# EAGLE schematic Muntjac (EAGLE 6.5.0)

## Sheet 1 of 6: CC2538 Core
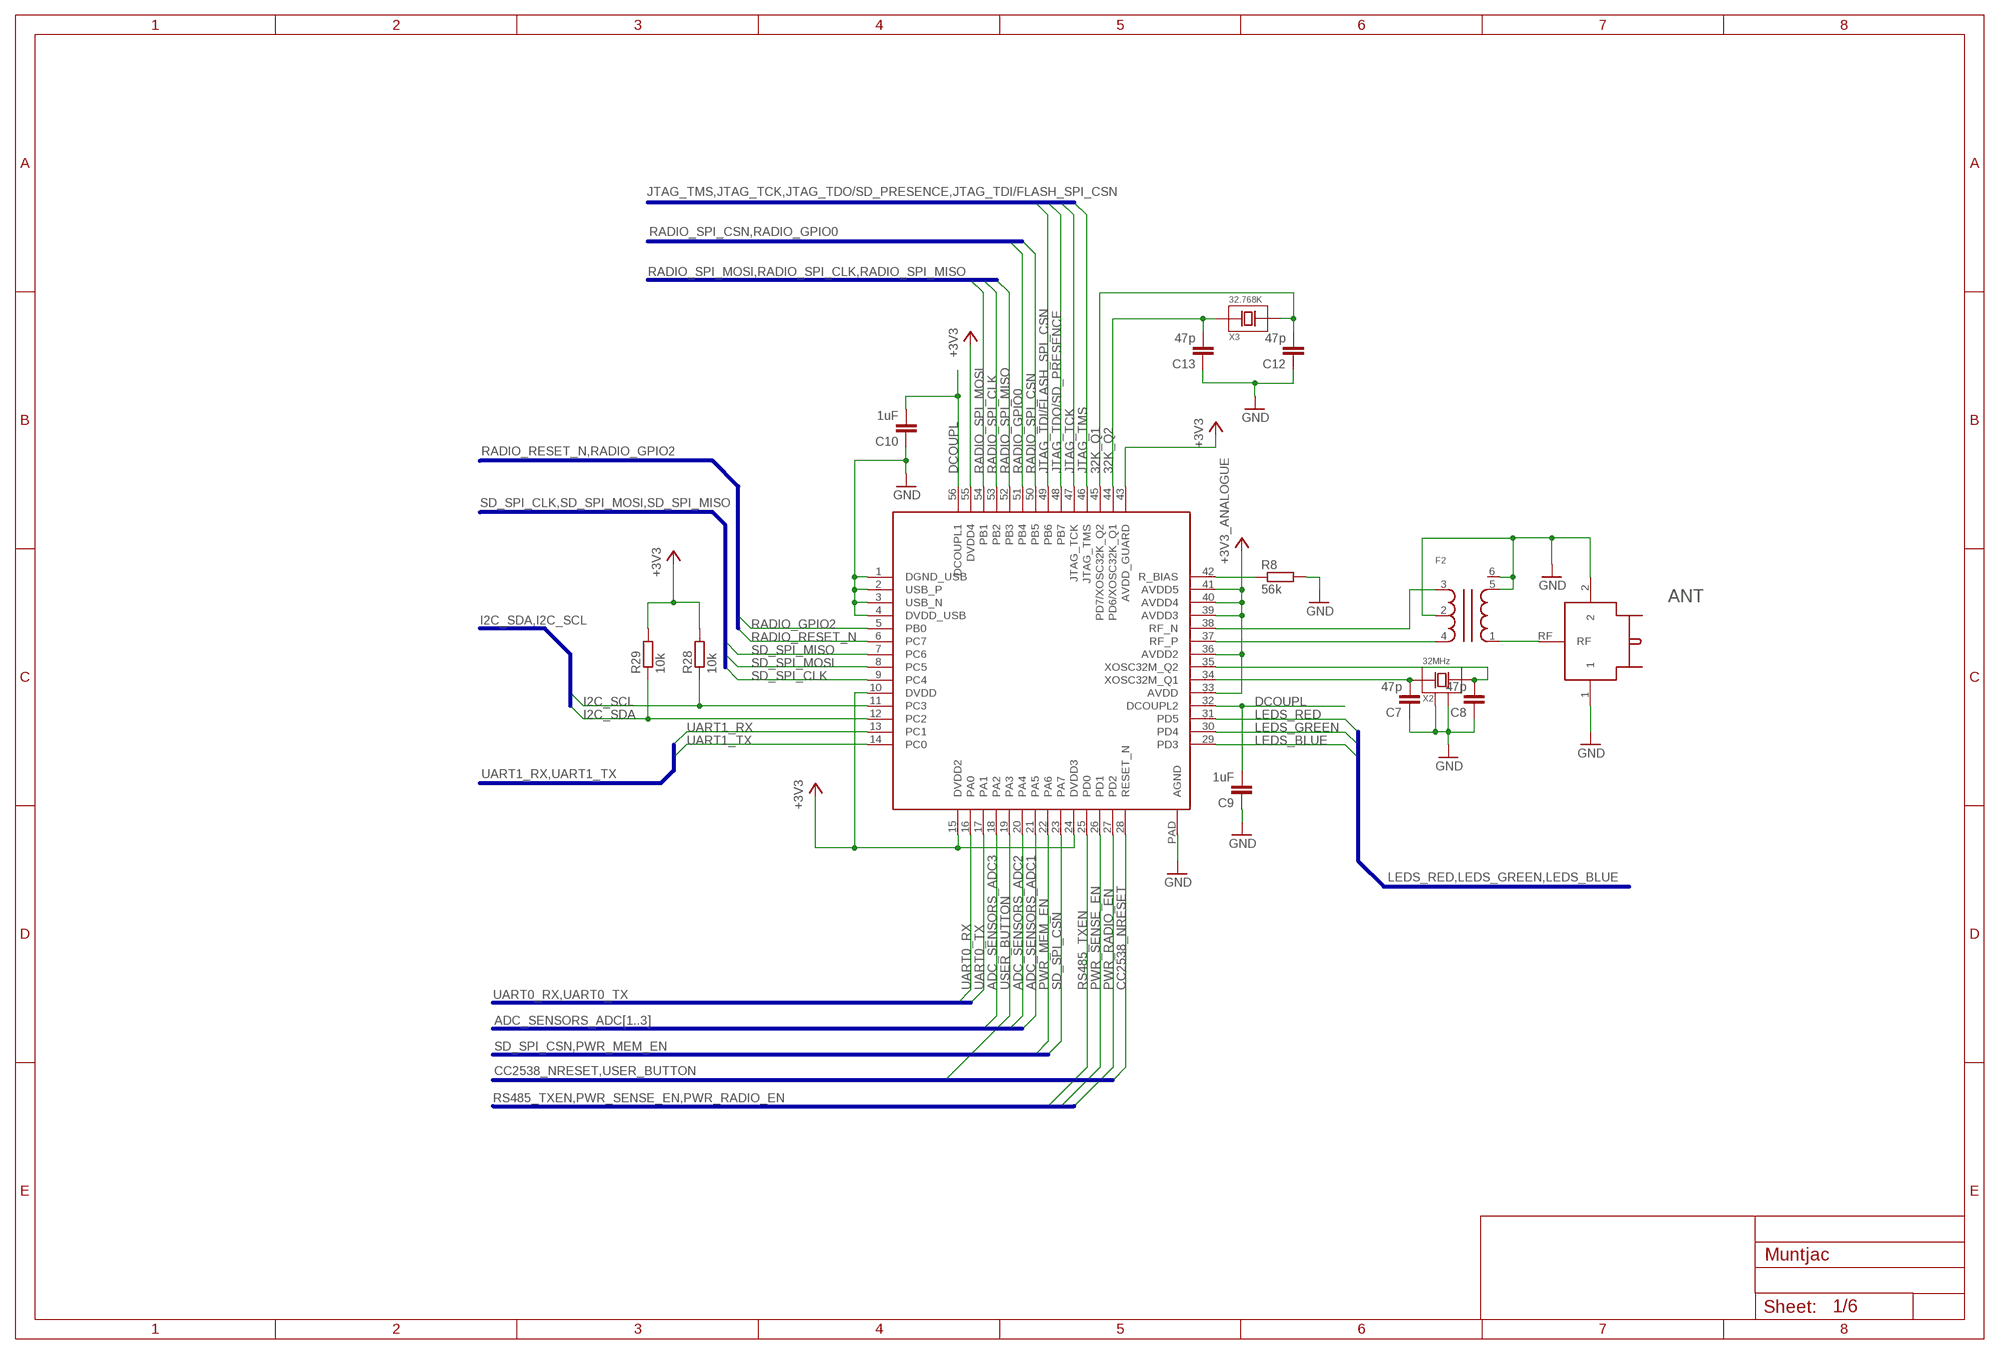
[diagram p0: schematic, sheet 1]

### Parts
ANT  UFL  [UFL-HIROSE]
C7  47p  C-EUC0603  [C0603]
C8  47p  C-EUC0603  [C0603]
C9  1uF  C-EUC0603  [C0603]
C10  1uF  C-EUC0603  [C0603]
C12  47p  C-EUC0603  [C0603]
C13  47p  C-EUC0603  [C0603]
F2  BALUN-2.4G  [2450BM15A0015]
R8  56k  R-EU_R0603  [R0603]
R28  10k  R-EU_R0603  [R0603]
R29  10k  R-EU_R0603  [R0603]
U1  CC2538  [QFN56]
X2  32MHz  ABM8G-ABM8G  [XTAL-3.2X2.5]
X3  32.768K  ABS07  [XTAL-3.2X1.5]

### Nets
2.4G: ANT.RF F2.1
32K_Q1: C12.2 U1.45(PD7/XOSC32K_Q2) X3.2
32K_Q2: C13.2 U1.44(PD6/XOSC32K_Q1) X3.1
32M_Q1: C7.2 U1.34(XOSC32M_Q1) X2.1
32M_Q2: C8.2 U1.35(XOSC32M_Q2) X2.3
+3V3: R28.2 R29.2 U1.10(DVDD) U1.15(DVDD2) U1.24(DVDD3) U1.43(AVDD_GUARD) U1.55(DVDD4) ; also sheet 2,4,5,6
+3V3_ANALOGUE: U1.33(AVDD) U1.36(AVDD2) U1.39(AVDD3) U1.40(AVDD4) U1.41(AVDD5) ; also sheet 5,6
ADC_SENSORS_ADC1: U1.21(PA5) ; also sheet 6
ADC_SENSORS_ADC2: U1.20(PA4) ; also sheet 6
ADC_SENSORS_ADC3: U1.18(PA2) ; also sheet 6
CC2538_NRESET: U1.28(RESET_N) ; also sheet 3,5,6
DCOUPL: C9.2 C10.2 U1.32(DCOUPL2) U1.56(DCOUPL1)
GND: ANT.1 ANT.2 C7.1 C8.1 C9.1 C10.1 C12.1 C13.1 F2.2 F2.5 F2.6 R8.2 U1.1(DGND_USB) U1.2(USB_P) U1.3(USB_N) U1.4(DVDD_USB) U1.PAD(AGND) X2.2 X2.4 ; also sheet 2,3,4,5,6
I2C_SCL: R28.1 U1.11(PC3) ; also sheet 5,6
I2C_SDA: R29.1 U1.12(PC2) ; also sheet 5,6
JTAG_TCK: U1.47(JTAG_TCK) ; also sheet 6
JTAG_TDI/FLASH_SPI_CSN: U1.49(PB6) ; also sheet 4,6
JTAG_TDO/SD_PRESENCE: U1.48(PB7) ; also sheet 4,6
JTAG_TMS: U1.46(JTAG_TMS) ; also sheet 6
LEDS_BLUE: U1.29(PD3) ; also sheet 5
LEDS_GREEN: U1.30(PD4) ; also sheet 5
LEDS_RED: U1.31(PD5) ; also sheet 5
N$21: R8.1 U1.42(R_BIAS)
N$28: F2.4 U1.37(RF_P)
N$29: F2.3 U1.38(RF_N)
PWR_MEM_EN: U1.22(PA6) ; also sheet 4
PWR_RADIO_EN: U1.27(PD2) ; also sheet 2,6
PWR_SENSE_EN: U1.26(PD1) ; also sheet 5,6
RADIO_GPIO0: U1.51(PB4) ; also sheet 2,6
RADIO_GPIO2: U1.5(PB0) ; also sheet 2,6
RADIO_RESET_N: U1.6(PC7) ; also sheet 2,6
RADIO_SPI_CLK: U1.53(PB2) ; also sheet 2,6
RADIO_SPI_CSN: U1.50(PB5) ; also sheet 2,6
RADIO_SPI_MISO: U1.52(PB3) ; also sheet 2,6
RADIO_SPI_MOSI: U1.54(PB1) ; also sheet 2,6
RS485_TXEN: U1.25(PD0) ; also sheet 6
SD_SPI_CLK: U1.9(PC4) ; also sheet 4,6
SD_SPI_CSN: U1.23(PA7) ; also sheet 4
SD_SPI_MISO: U1.7(PC6) ; also sheet 4,6
SD_SPI_MOSI: U1.8(PC5) ; also sheet 4,6
UART0_RX: U1.16(PA0) ; also sheet 3,6
UART0_TX: U1.17(PA1) ; also sheet 3,6
UART1_RX: U1.13(PC1) ; also sheet 6
UART1_TX: U1.14(PC0) ; also sheet 6
USER_BUTTON: U1.19(PA3) ; also sheet 3,5,6

### Buses
UART1_RX,UART1_TX
SD_SPI_CLK,SD_SPI_MOSI,SD_SPI_MISO
UART0_RX,UART0_TX
RADIO_SPI_MOSI,RADIO_SPI_CLK,RADIO_SPI_MISO
JTAG_TMS,JTAG_TCK,JTAG_TDO/SD_PRESENCE,JTAG_TDI/FLASH_SPI_CSN
RADIO_SPI_CSN,RADIO_GPIO0
LEDS_RED,LEDS_GREEN,LEDS_BLUE
ADC_SENSORS_ADC[1..3]
CC2538_NRESET,USER_BUTTON
SD_SPI_CSN,PWR_MEM_EN
RS485_TXEN,PWR_SENSE_EN,PWR_RADIO_EN
RADIO_RESET_N,RADIO_GPIO2
I2C_SDA,I2C_SCL

## Sheet 2 of 6: CC1200
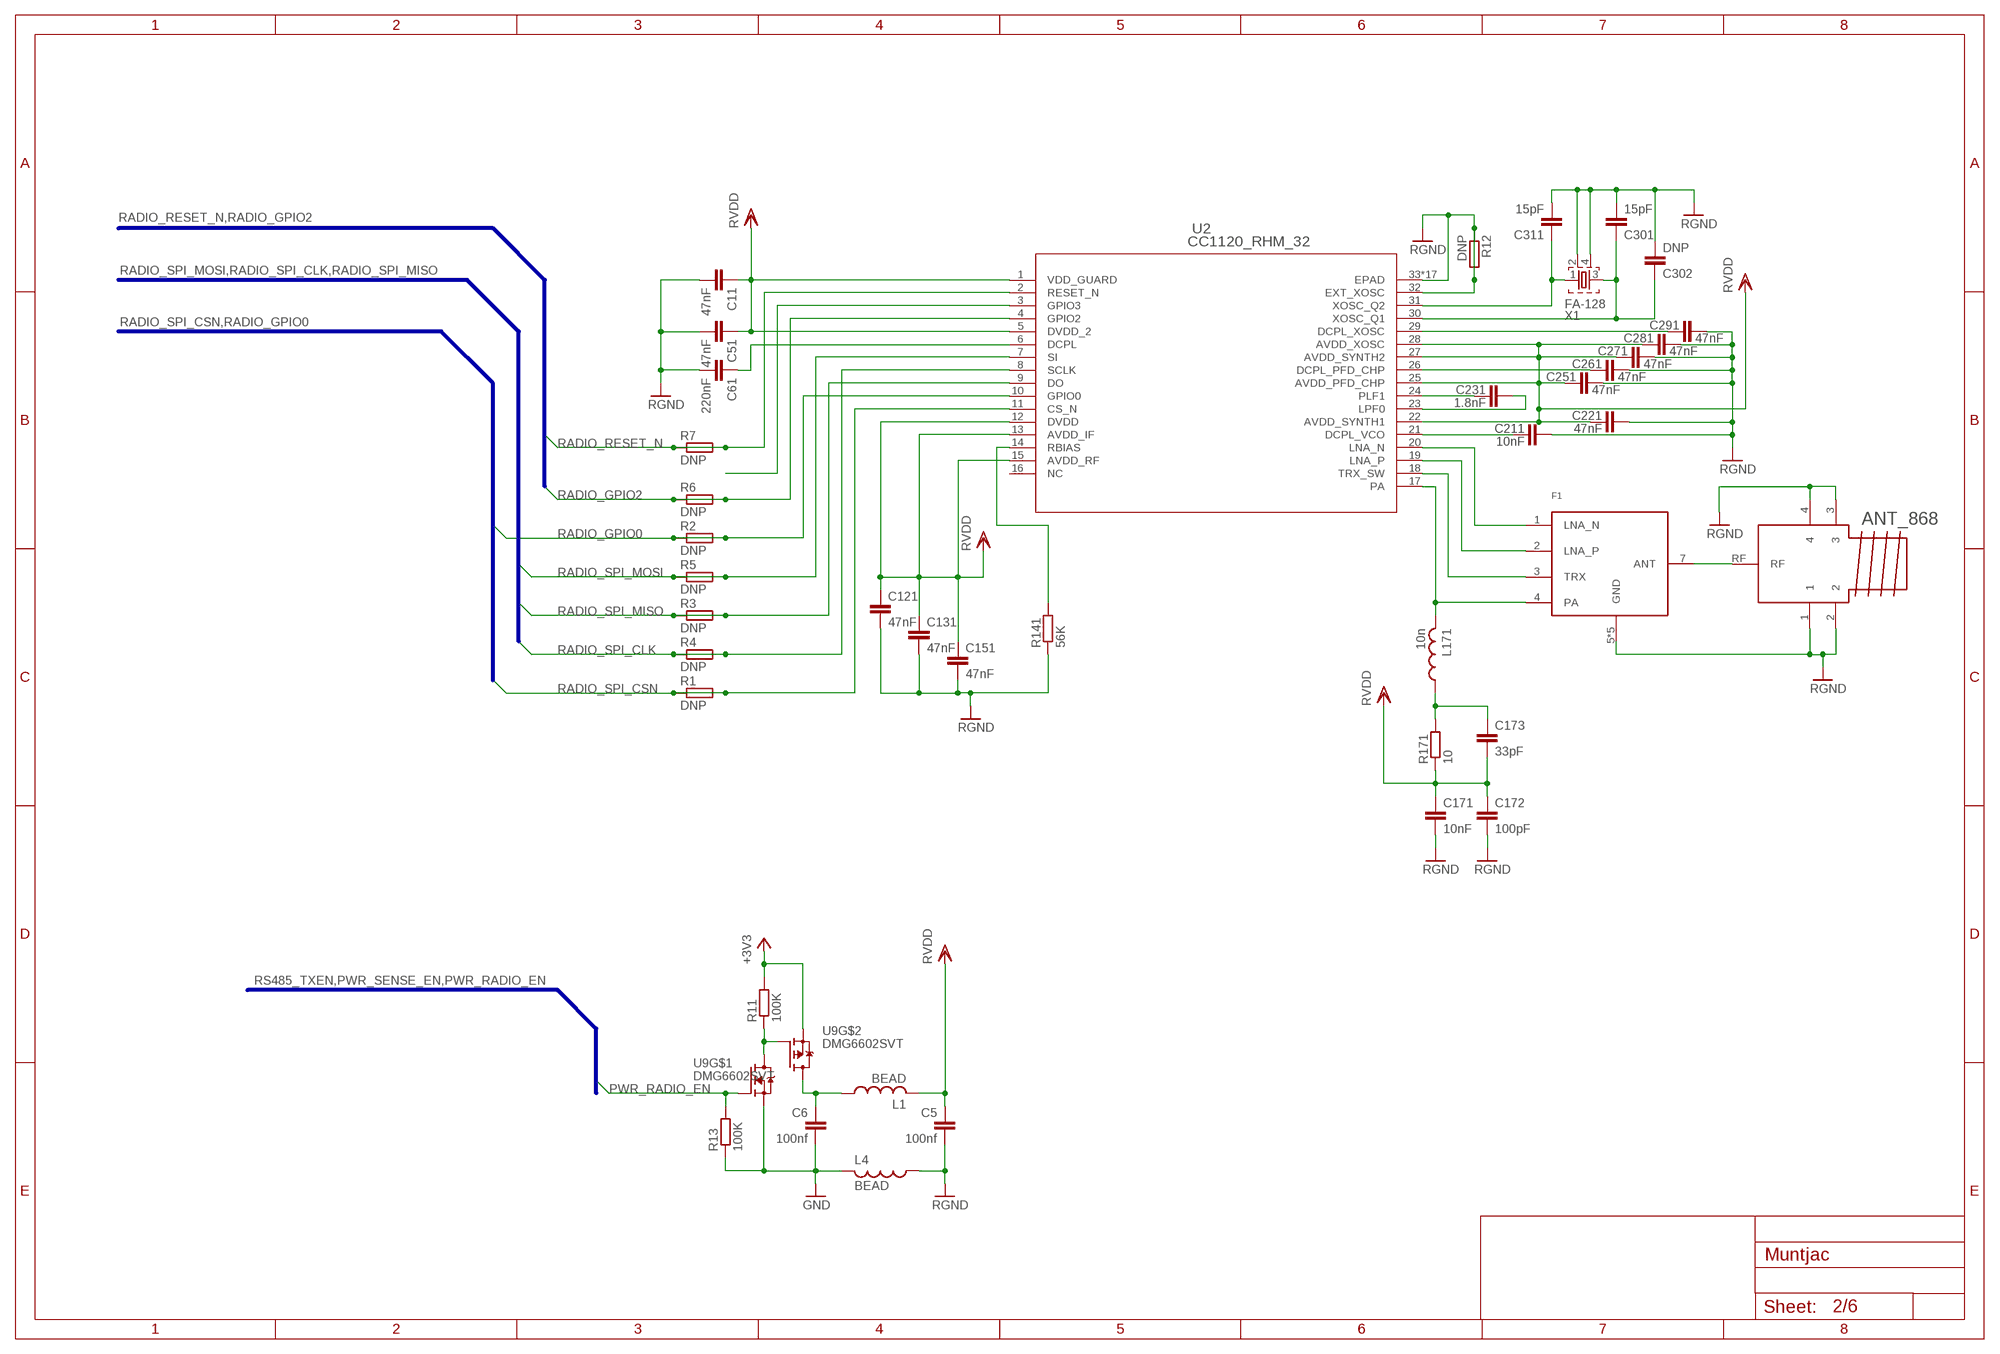
[diagram p1: schematic, sheet 2]

### Parts
ANT_868  SMA  [JOHNSON_142-0701-806]
C5  100nf  C_EUC0603S  [C0603]
C6  100nf  C_EUC0603S  [C0603]
C11  47nF  C_EU0402S  [C0402_SMALL]
C51  47nF  C_EU0402S  [C0402_SMALL]
C61  220nF  C_EU0402S  [C0402_SMALL]
C121  47nF  C_EU0402S  [C0402_SMALL]
C131  47nF  C_EU0402S  [C0402_SMALL]
C151  47nF  C_EU0402S  [C0402_SMALL]
C171  10nF  C_EU0402S  [C0402_SMALL]
C172  100pF  C_EU0402S  [C0402_SMALL]
C173  33pF  C_EU0402S  [C0402_SMALL]
C211  10nF  C_EU0402S  [C0402_SMALL]
C221  47nF  C_EU0402S  [C0402_SMALL]
C231  1.8nF  C_EU0402S  [C0402_SMALL]
C251  47nF  C_EU0402S  [C0402_SMALL]
C261  47nF  C_EU0402S  [C0402_SMALL]
C271  47nF  C_EU0402S  [C0402_SMALL]
C281  47nF  C_EU0402S  [C0402_SMALL]
C291  47nF  C_EU0402S  [C0402_SMALL]
C301  15pF  C_EU0402S  [C0402_SMALL]
C302  DNP  C_EU0402S  [C0402_SMALL]
C311  15pF  C_EU0402S  [C0402_SMALL]
F1  0900PC15J0013  [0900PC15J0013]
L1  BEAD  L_US0603  [C0603]
L4  BEAD  L_US0603  [C0603]
L171  10n  L_US0402S  [C0402_SMALL]
R1  DNP  R-EU_R0402  [R0402]
R2  DNP  R-EU_R0402  [R0402]
R3  DNP  R-EU_R0402  [R0402]
R4  DNP  R-EU_R0402  [R0402]
R5  DNP  R-EU_R0402  [R0402]
R6  DNP  R-EU_R0402  [R0402]
R7  DNP  R-EU_R0402  [R0402]
R11  100K  R-EU_R0603  [R0603]
R12  DNP  R_EU  [C0402_SMALL]
R13  100K  R-EU_R0603  [R0603]
R141  56K  R_EU  [C0402_SMALL]
R171  10  R_EU  [C0402_SMALL]
U2  CC1120_RHM_32  [RHM32_3P7X3P7]
U9  DMG6602SVT  [TSOT26]
X1  FA-128  [FA-128]

### Nets
+3V3: R11.2 U9.P$2(S) ; also sheet 1,4,5,6
GND: C6.2 L4.2 R13.1 U9.P$5(S) ; also sheet 1,3,4,5,6
N$1: C231.1 U2.24(PLF1)
N$2: C231.2 U2.23(LPF0)
N$3: C211.1 U2.21(DCPL_VCO)
N$4: C61.1 U2.6(DCPL)
N$5: C261.1 U2.26(DCPL_PFD_CHP)
N$6: C311.1 U2.31(XOSC_Q2) X1.1
N$7: C301.1 C302.1 U2.30(XOSC_Q1) X1.3
N$8: C291.1 U2.29(DCPL_XOSC)
N$9: F1.1(LNA_N) U2.20(LNA_N)
N$10: F1.2(LNA_P) U2.19(LNA_P)
N$11: ANT_868.RF F1.7(ANT)
N$12: F1.3(TRX) U2.18(TRX_SW)
N$13: R141.2 U2.14(RBIAS)
N$14: F1.4(PA) L171.2 U2.17(PA)
N$19: C173.1 L171.1 R171.2
N$31: C6.1 L1.1 U9.P$4(D)
N$34: R11.1 U9.P$3(G) U9.P$6(D)
PWR_RADIO_EN: R13.2 U9.P$1(G) ; also sheet 1,6
RADIO_GPIO0: R2.1 R2.2 U2.10(GPIO0) ; also sheet 1,6
RADIO_GPIO2: R6.1 R6.2 U2.4(GPIO2) ; also sheet 1,6
RADIO_GPIO3: U2.3(GPIO3)
RADIO_RESET_N: R7.1 R7.2 U2.2(RESET_N) ; also sheet 1,6
RADIO_SPI_CLK: R4.1 R4.2 U2.8(SCLK) ; also sheet 1,6
RADIO_SPI_CSN: R1.1 R1.2 U2.11(CS_N) ; also sheet 1,6
RADIO_SPI_MISO: R3.1 R3.2 U2.9(DO) ; also sheet 1,6
RADIO_SPI_MOSI: R5.1 R5.2 U2.7(SI) ; also sheet 1,6
RGND: ANT_868.1 ANT_868.2 ANT_868.3 ANT_868.4 C5.2 C11.2 C51.2 C61.2 C121.2 C131.2 C151.2 C171.2 C172.2 C211.2 C221.2 C251.2 C261.2 C271.2 C281.2 C291.2 C301.2 C302.2 C311.2 F1.5(GND) F1.6(GND) F1.8(GND) F1.9(GND) F1.10(GND) L4.1 R12.1 R12.2 R141.1 U2.32(EXT_XOSC) U2.33(EPAD) U2.V(EPAD) U2.V_2(EPAD) U2.V_3(EPAD) U2.V_4(EPAD) U2.V_5(EPAD) U2.V_6(EPAD) U2.V_7(EPAD) U2.V_8(EPAD) U2.V_9(EPAD) U2.V_10(EPAD) U2.V_11(EPAD) U2.V_12(EPAD) U2.V_13(EPAD) U2.V_14(EPAD) U2.V_15(EPAD) U2.V_16(EPAD) X1.2 X1.4
RVDD: C5.1 C11.1 C51.1 C121.1 C131.1 C151.1 C171.1 C172.1 C173.2 C221.1 C251.1 C271.1 C281.1 L1.2 R171.1 U2.1(VDD_GUARD) U2.5(DVDD_2) U2.12(DVDD) U2.13(AVDD_IF) U2.15(AVDD_RF) U2.22(AVDD_SYNTH1) U2.25(AVDD_PFD_CHP) U2.27(AVDD_SYNTH2) U2.28(AVDD_XOSC)
Unconnected: U2.16(NC)

### Buses
RS485_TXEN,PWR_SENSE_EN,PWR_RADIO_EN
RADIO_SPI_CSN,RADIO_GPIO0
RADIO_SPI_MOSI,RADIO_SPI_CLK,RADIO_SPI_MISO
RADIO_RESET_N,RADIO_GPIO2

## Sheet 3 of 6: BSL/Serial Interface
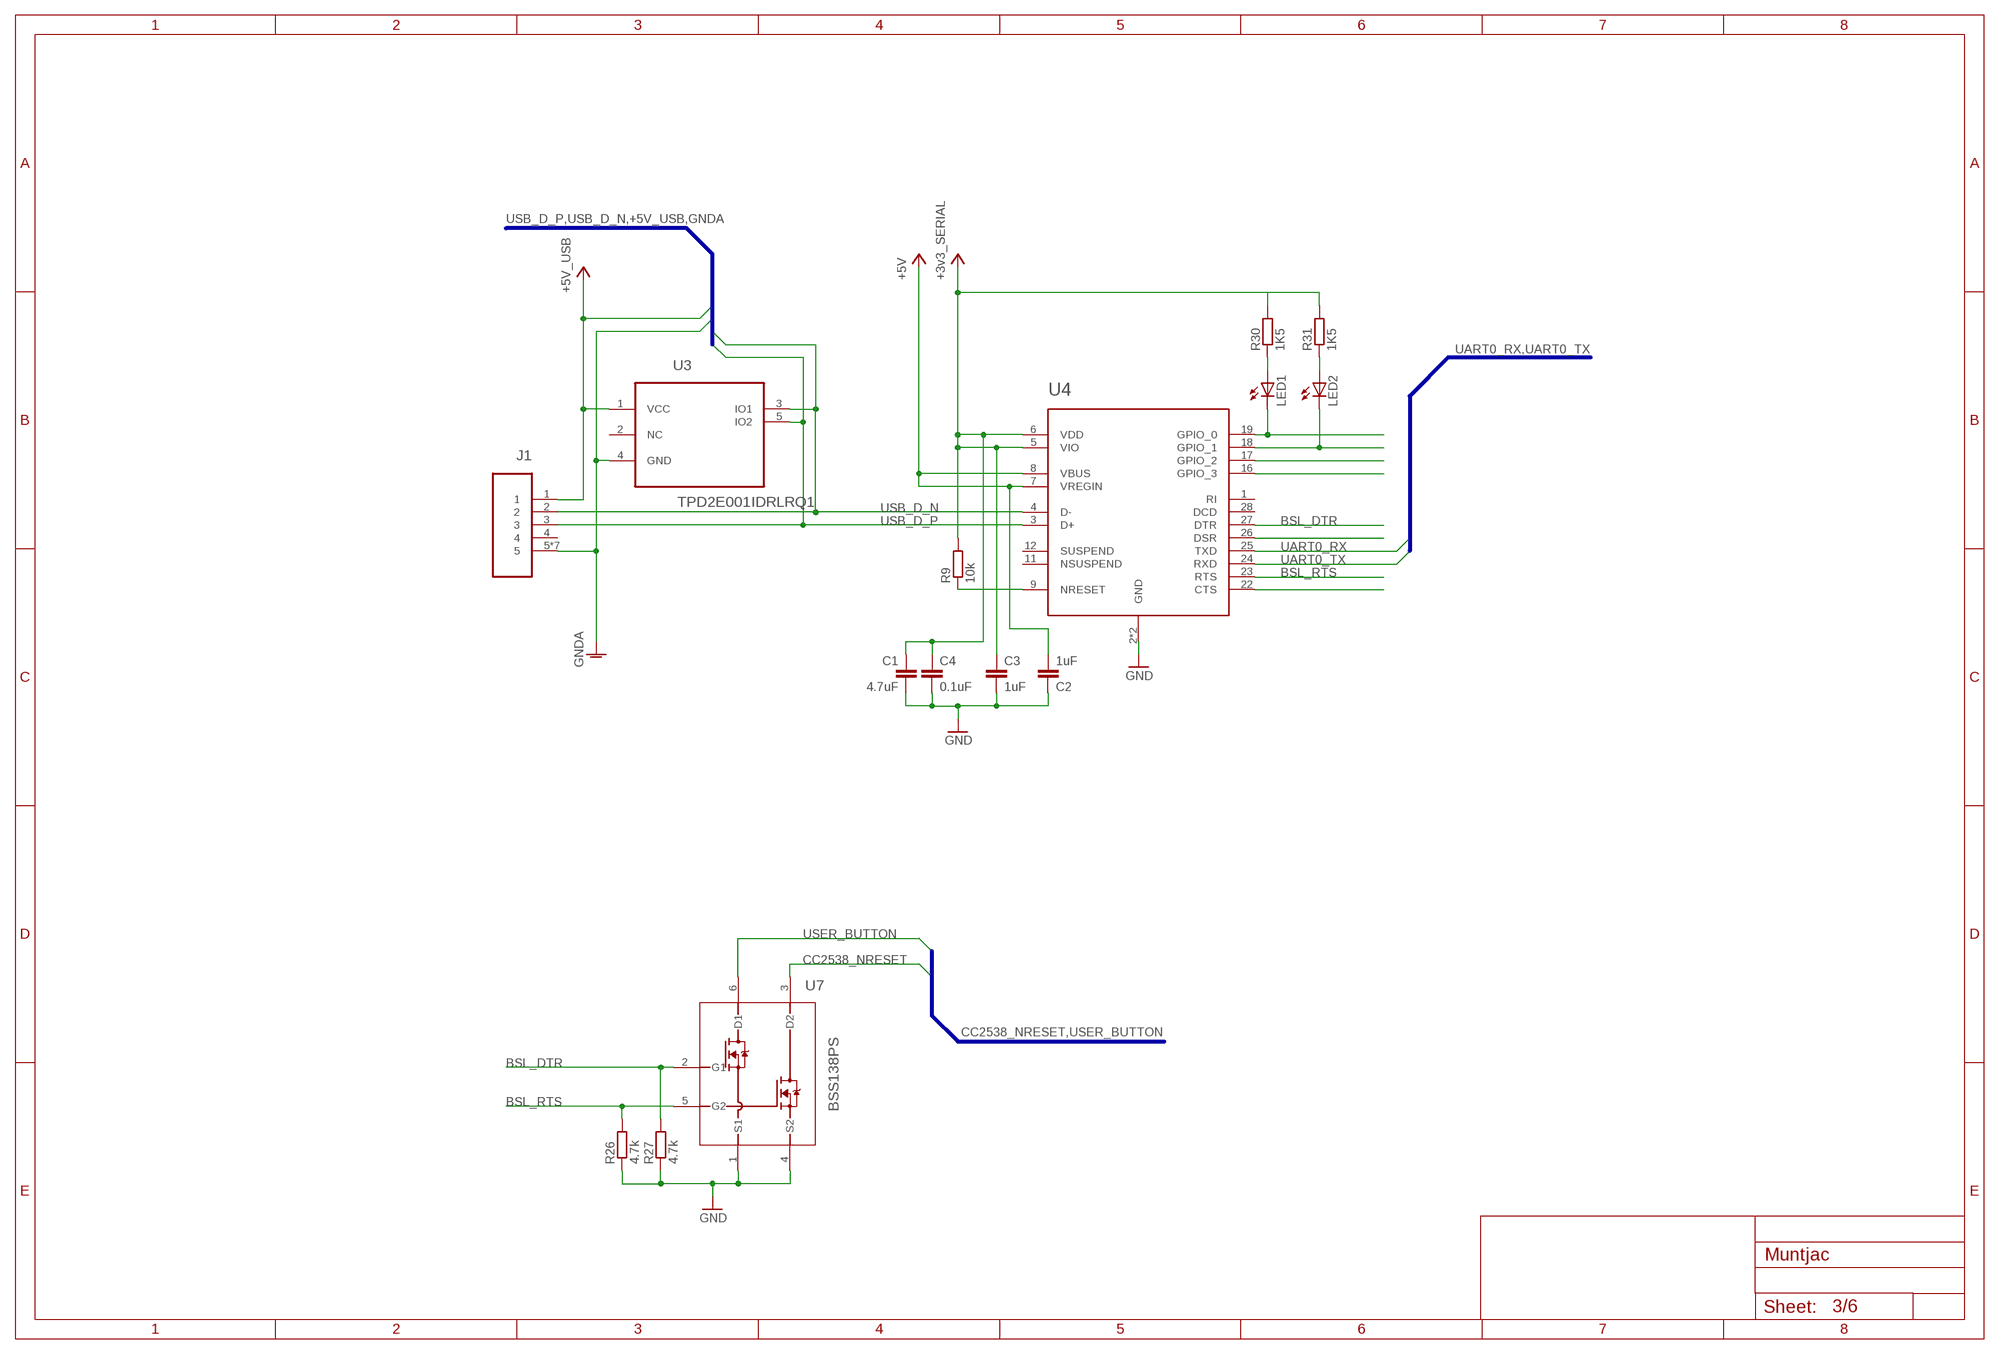
[diagram p2: schematic, sheet 3]

### Parts
C1  4.7uF  C_EUC0603S  [C0603]
C2  1uF  C_EUC0603S  [C0603]
C3  1uF  C_EUC0603S  [C0603]
C4  0.1uF  C_EUC0603S  [C0603]
J1  47346-0001  [MOLEX_47346-0001]
LED1  LEDSML0603  [SML0603]
LED2  LEDSML0603  [SML0603]
R9  10k  R-EU_R0603  [R0603]
R26  4.7k  R-EU_R0603  [R0603]
R27  4.7k  R-EU_R0603  [R0603]
R30  1K5  R-EU_R0603  [R0603]
R31  1K5  R-EU_R0603  [R0603]
U3  TPD2E001IDRLRQ1  [SOT50P160X60-5N]
U4  CP2103  [QFN50P500X500X100-29N]
U7  BSS138PS  [SOT65P210X110-6N]

### Nets
+3V3_SERIAL: C1.1 C3.1 C4.1 R9.2 R30.2 R31.2 U4.5(VIO) U4.6(VDD) ; supply symbol labelled +3v3_SERIAL ; also sheet 5,6
+5V: C2.2 U4.7(VREGIN) U4.8(VBUS) ; also sheet 5
+5V_USB: J1.1 U3.1(VCC) ; also sheet 5,6
BSL_DTR: R27.2 U4.27(DTR) U7.2(G1)
BSL_RTS: R26.2 U4.23(RTS) U7.5(G2)
CC2538_NRESET: U7.3(D2) ; also sheet 1,5,6
GND: C1.2 C2.1 C3.2 C4.2 R26.1 R27.1 U4.2(GND) U4.29(GND) U7.1(S1) U7.4(S2) ; also sheet 1,2,4,5,6
GNDA: J1.5 J1.M1 J1.M2 J1.M3 J1.M4 J1.M5 J1.M6 U3.4(GND) ; also sheet 5,6
N$15: LED1.C U4.19(GPIO_0)
N$16: U4.26(DSR)
N$17: LED2.C U4.18(GPIO_1)
N$18: U4.22(CTS)
N$20: LED1.A R30.1
N$26: U4.17(GPIO_2)
N$27: R9.1 U4.9(NRESET)
N$30: U4.16(GPIO_3)
N$40: LED2.A R31.1
UART0_RX: U4.25(TXD) ; also sheet 1,6
UART0_TX: U4.24(RXD) ; also sheet 1,6
USB_D_N: J1.2 U3.3(IO1) U4.4(D-) ; also sheet 6
USB_D_P: J1.3 U3.5(IO2) U4.3(D+) ; also sheet 6
USER_BUTTON: U7.6(D1) ; also sheet 1,5,6
Unconnected: J1.4 U3.2(NC) U4.1(RI) U4.11(NSUSPEND) U4.12(SUSPEND) U4.28(DCD)

### Buses
USB_D_P,USB_D_N,+5V_USB,GNDA
UART0_RX,UART0_TX
CC2538_NRESET,USER_BUTTON

## Sheet 4 of 6: Storage
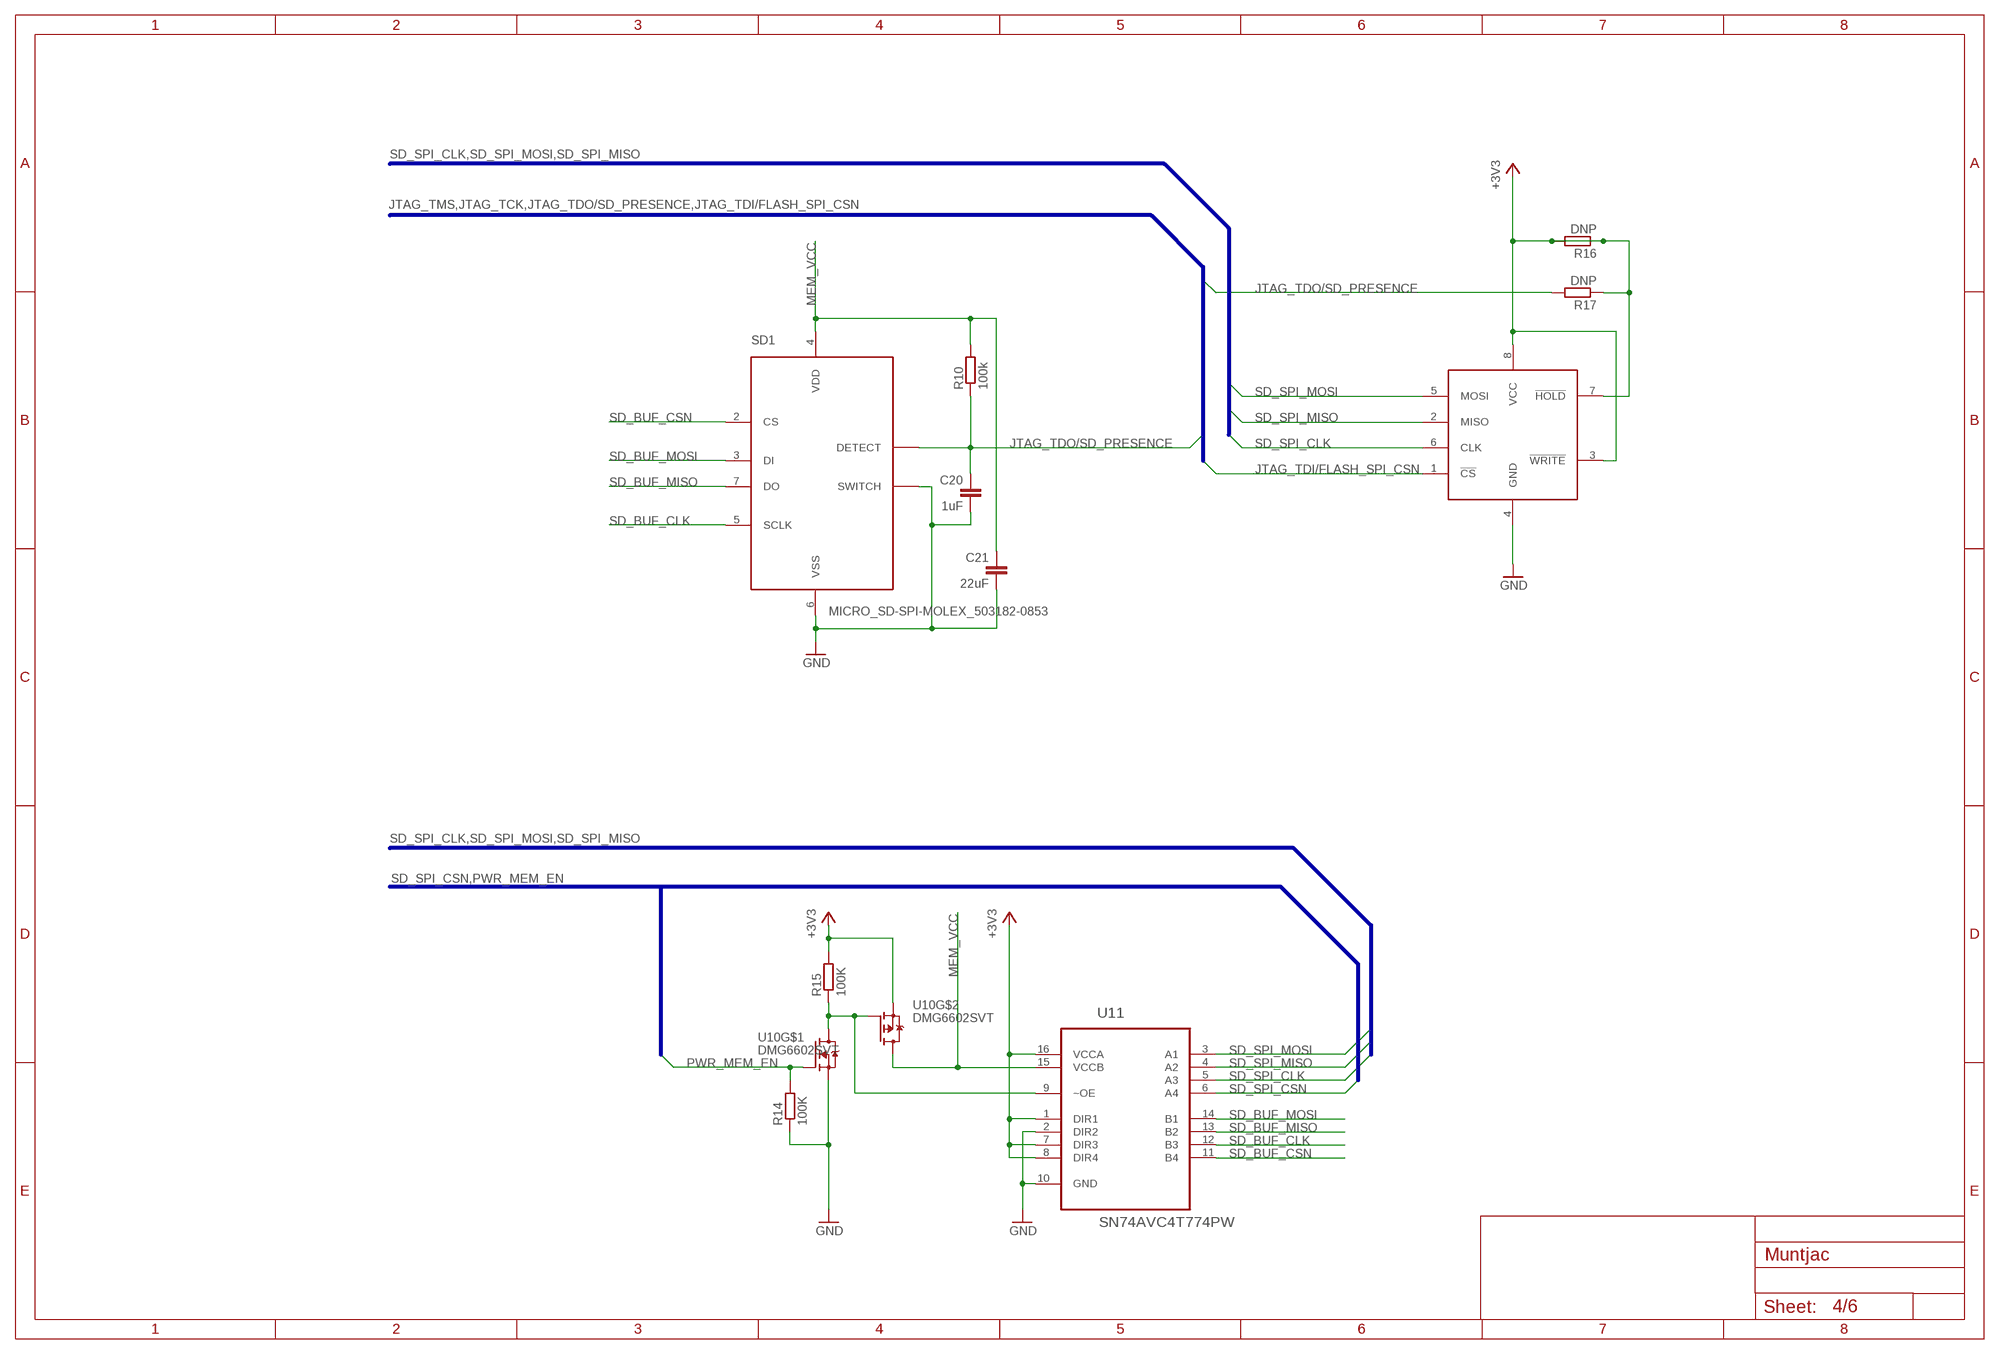
[diagram p3: schematic, sheet 4]

### Parts
C20  1uF  C_EUC0603S  [C0603]
C21  22uF  C_EUC0603S  [C0603]
R10  100k  R-EU_R0603  [R0603]
R14  100K  R-EU_R0603  [R0603]
R15  100K  R-EU_R0603  [R0603]
R16  DNP  R-EU_R0402  [R0402]
R17  DNP  R-EU_R0402  [R0402]
SD1  MICRO_SD-SPI-MOLEX_503182-0853  [MICRO_SD-MOLEX_503182-0853]
U8  M25P16VMN6P  [SOIC8]
U10  DMG6602SVT  [TSOT26]
U11  SN74AVC4T774PW  [SOP65P640X120-16N]

### Nets
+3V3: R15.2 R16.1 R16.2 R17.1 U8.3(!WRITE) U8.7(!HOLD) U8.8(VCC) U10.P$2(S) U11.1(DIR1) U11.7(DIR3) U11.8(DIR4) U11.16(VCCA) ; also sheet 1,2,5,6
GND: C20.2 C21.2 R14.1 SD1.6(VSS) SD1.SWITCH U8.4(GND) U10.P$5(S) U11.2(DIR2) U11.10(GND) ; also sheet 1,2,3,5,6
JTAG_TDI/FLASH_SPI_CSN: U8.1(!CS) ; also sheet 1,6
JTAG_TDO/SD_PRESENCE: C20.1 R10.1 R17.2 SD1.DETECT ; also sheet 1,6
MEM_VCC: C21.1 R10.2 SD1.4(VDD) U10.P$4(D) U11.15(VCCB)
N$42: R15.1 U10.P$3(G) U10.P$6(D) U11.9(~OE)
PWR_MEM_EN: R14.2 U10.P$1(G) ; also sheet 1
SD_BUF_CLK: SD1.5(SCLK) U11.12(B3)
SD_BUF_CSN: SD1.2(CS) U11.11(B4)
SD_BUF_MISO: SD1.7(DO) U11.13(B2)
SD_BUF_MOSI: SD1.3(DI) U11.14(B1)
SD_SPI_CLK: U8.6(CLK) U11.5(A3) ; also sheet 1,6
SD_SPI_CSN: U11.6(A4) ; also sheet 1
SD_SPI_MISO: U8.2(MISO) U11.4(A2) ; also sheet 1,6
SD_SPI_MOSI: U8.5(MOSI) U11.3(A1) ; also sheet 1,6

### Buses
SD_SPI_CLK,SD_SPI_MOSI,SD_SPI_MISO
SD_SPI_CSN,PWR_MEM_EN
JTAG_TMS,JTAG_TCK,JTAG_TDO/SD_PRESENCE,JTAG_TDI/FLASH_SPI_CSN

## Sheet 5 of 6: Power & HMI
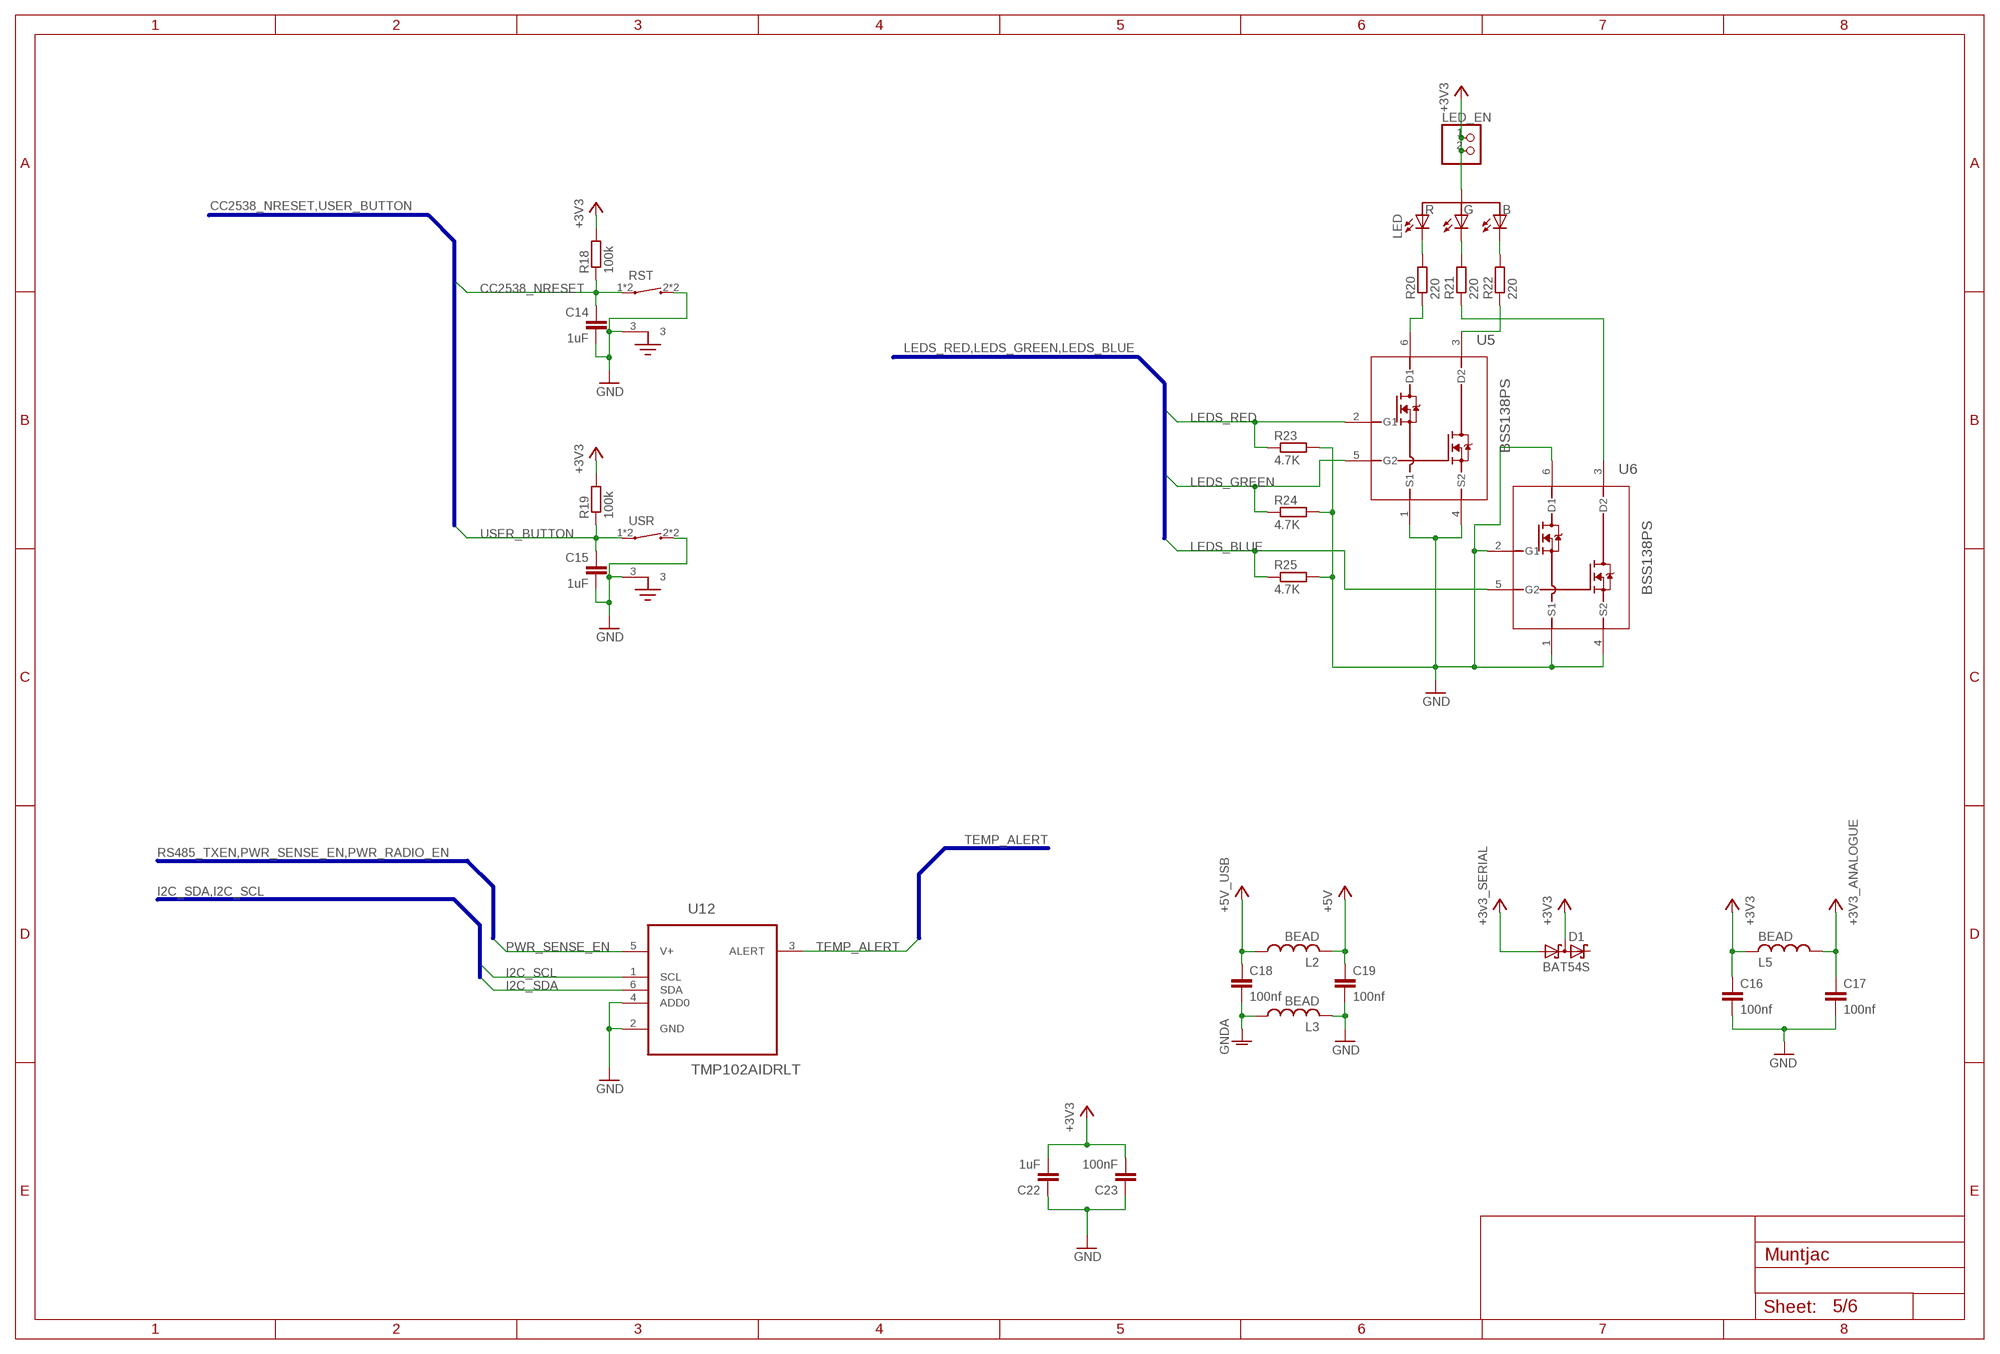
[diagram p4: schematic, sheet 5]

### Parts
C14  1uF  C_EUC0603S  [C0603]
C15  1uF  C_EUC0603S  [C0603]
C16  100nf  C_EUC0603S  [C0603]
C17  100nf  C_EUC0603S  [C0603]
C18  100nf  C_EUC0603S  [C0603]
C19  100nf  C_EUC0603S  [C0603]
C22  1uF  C_EUC0603S  [C0603]
C23  100nF  C_EUC0603S  [C0603]
D1  BAT54S  [SOT23]
L2  BEAD  L_US0603  [C0603]
L3  BEAD  L_US0603  [C0603]
L5  BEAD  L_US0603  [C0603]
LED  CLV1A-FKB-CJ1M1F1BB7R4S3  [PLCC-4_3.2X2.8]
LED_EN  PINHD-1X2  [1X02]
R18  100k  R-EU_R0603  [R0603]
R19  100k  R-EU_R0603  [R0603]
R20  220  R-EU_R0603  [R0603]
R21  220  R-EU_R0603  [R0603]
R22  220  R-EU_R0603  [R0603]
R23  4.7K  R-EU_R0603  [R0603]
R24  4.7K  R-EU_R0603  [R0603]
R25  4.7K  R-EU_R0603  [R0603]
RST  KMR2X1G  [C&K-KMR-5MM]
U5  BSS138PS  [SOT65P210X110-6N]
U6  BSS138PS  [SOT65P210X110-6N]
U12  TMP102AIDRLT  [SOT50P160X60-6N]
USR  KMR2X1G  [C&K-KMR-5MM]

### Nets
+3V3: C16.1 C22.2 C23.2 D1.3(C1A2) L5.2 LED.2 LED_EN.1 LED_EN.2 R18.2 R19.2 ; also sheet 1,2,4,6
+3V3_ANALOGUE: C17.1 L5.1 ; also sheet 1,6
+3V3_SERIAL: D1.1(A1) ; supply symbol labelled +3v3_SERIAL ; also sheet 3,6
+5V: C19.1 L2.2 ; also sheet 3
+5V_USB: C18.1 L2.1 ; also sheet 3,6
CC2538_NRESET: C14.1 R18.1 RST.1 RST.5 ; also sheet 1,3,6
GND: C14.2 C15.2 C16.2 C17.2 C19.2 C22.1 C23.1 L3.2 R23.2 R24.2 R25.2 RST.2 RST.3 RST.4 U5.1(S1) U5.4(S2) U6.1(S1) U6.2(G1) U6.4(S2) U6.6(D1) U12.2(GND) U12.4(ADD0) USR.2 USR.3 USR.4 ; also sheet 1,2,3,4,6
GNDA: C18.2 L3.1 ; also sheet 3,6
I2C_SCL: U12.1(SCL) ; also sheet 1,6
I2C_SDA: U12.6(SDA) ; also sheet 1,6
LEDS_BLUE: R25.1 U6.5(G2) ; also sheet 1
LEDS_GREEN: R24.1 U5.5(G2) ; also sheet 1
LEDS_RED: R23.1 U5.2(G1) ; also sheet 1
N$22: LED.1 R20.2
N$23: LED.3 R21.2
N$24: LED.4 R22.2
N$25: R20.1 U5.6(D1)
N$32: R21.1 U6.3(D2)
N$33: R22.1 U5.3(D2)
PWR_SENSE_EN: U12.5(V+) ; also sheet 1,6
TEMP_ALERT: U12.3(ALERT) ; also sheet 6
USER_BUTTON: C15.1 R19.1 USR.1 USR.5 ; also sheet 1,3,6
Unconnected: D1.2(C2)

### Buses
CC2538_NRESET,USER_BUTTON
LEDS_RED,LEDS_GREEN,LEDS_BLUE
I2C_SDA,I2C_SCL
TEMP_ALERT
RS485_TXEN,PWR_SENSE_EN,PWR_RADIO_EN

## Sheet 6 of 6: Headers
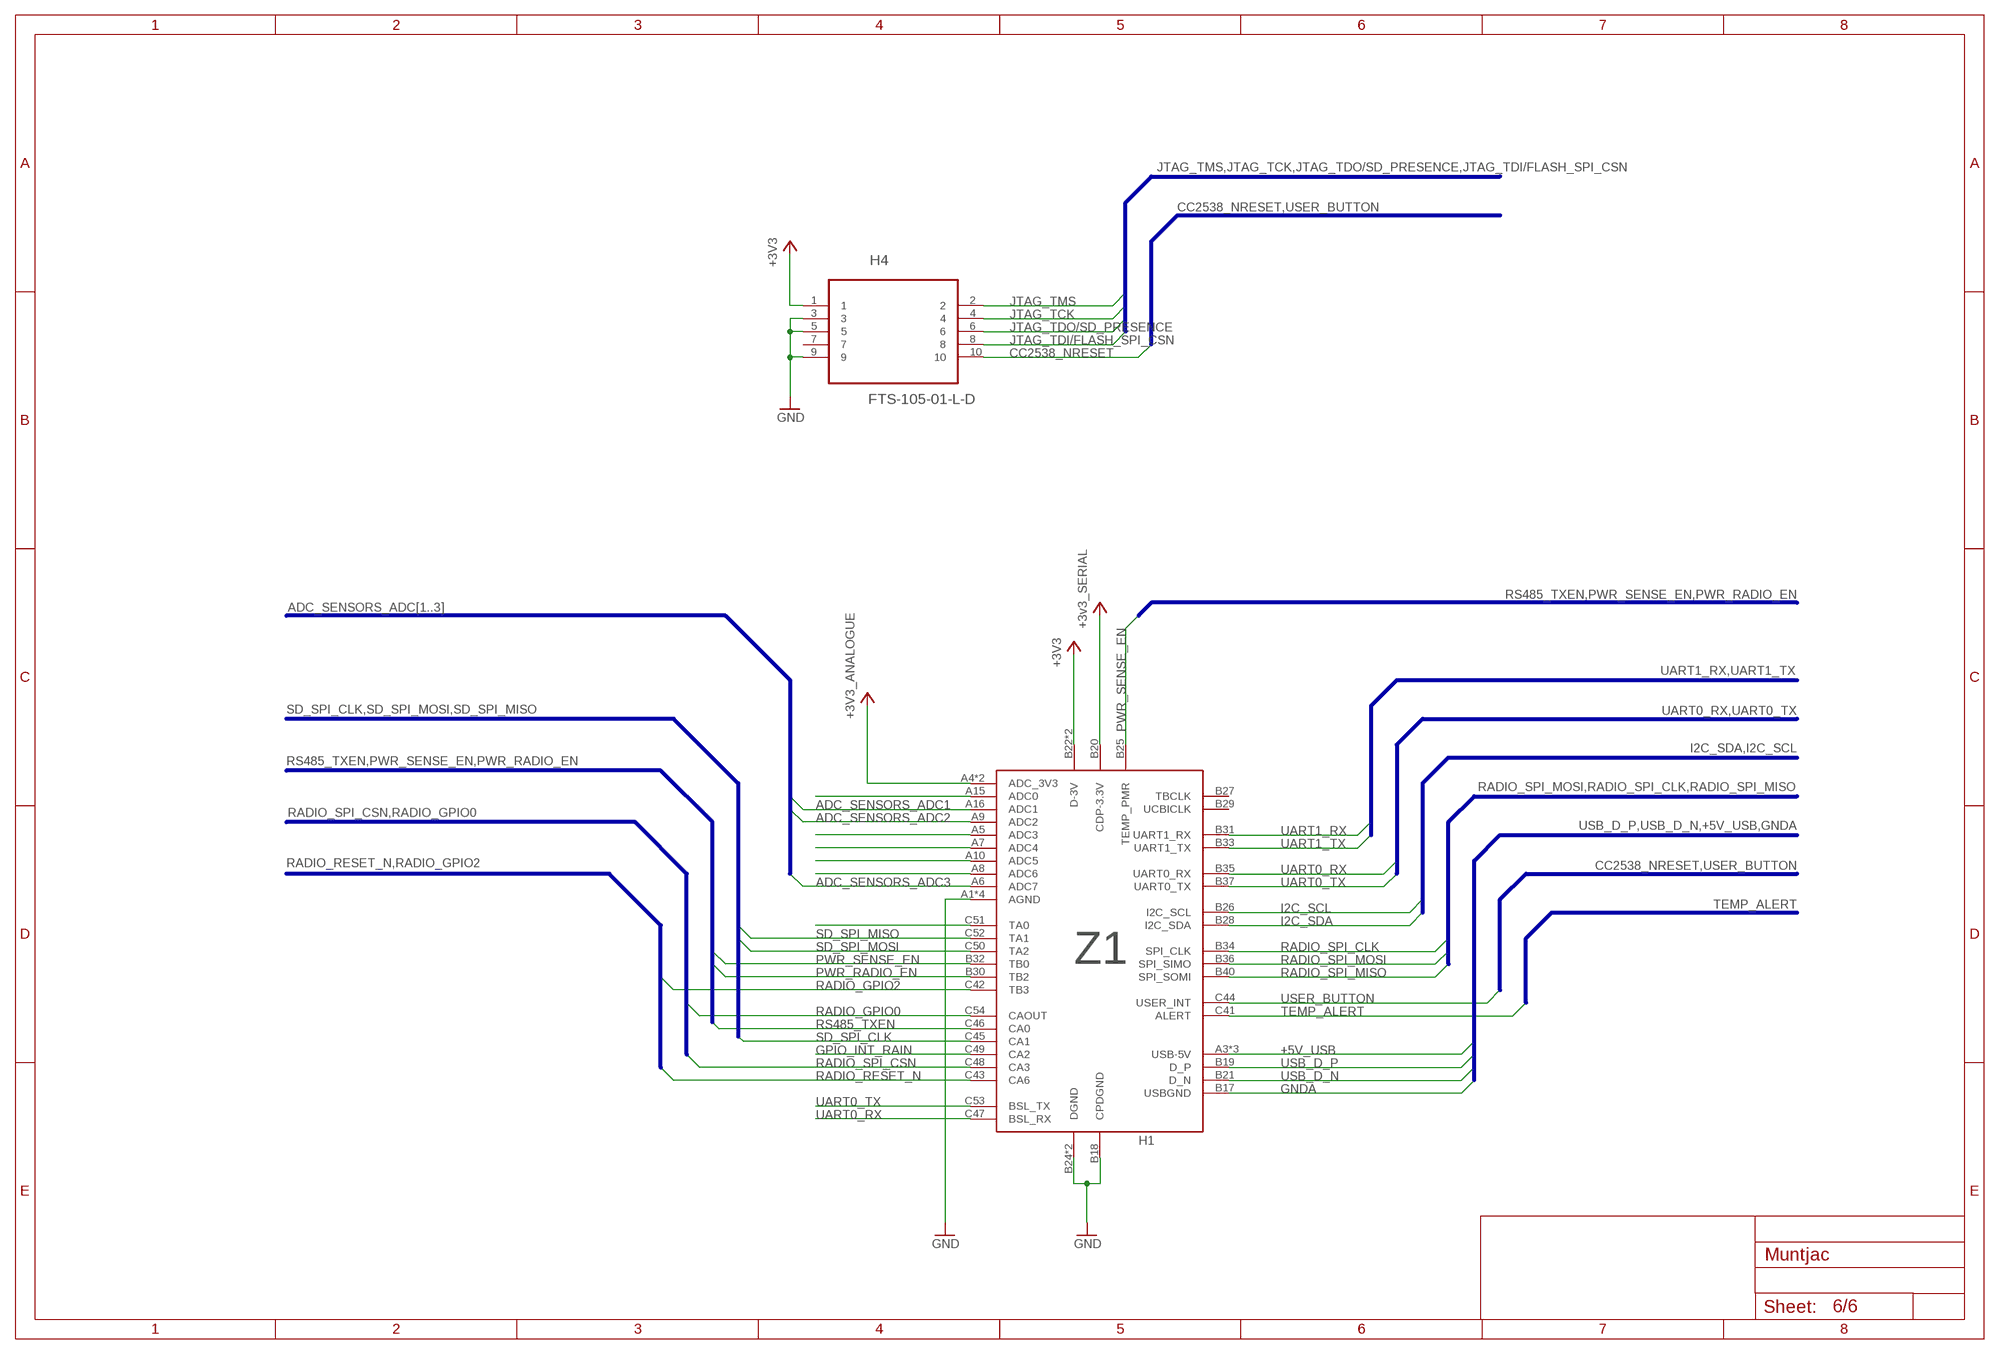
[diagram p5: schematic, sheet 6]

### Parts
H1  Z1  [Z1]
H4  FTS-105-01-L-D  [SAMTEC_FTS-105-01-L-D]

### Nets
+3V3: H1.B22(D-3V) H1.C40(D-3V) H4.1 ; also sheet 1,2,4,5
+3V3_ANALOGUE: H1.A4(ADC_3V3) H1.A14(ADC_3V3) ; also sheet 1,5
+3V3_SERIAL: H1.B20(CDP-3.3V) ; supply symbol labelled +3v3_SERIAL ; also sheet 3,5
+5V_USB: H1.A3(USB-5V) H1.A13(USB-5V) H1.B23(USB-5V) ; also sheet 3,5
ADC_SENSORS_ADC1: H1.A16(ADC1) ; also sheet 1
ADC_SENSORS_ADC2: H1.A9(ADC2) ; also sheet 1
ADC_SENSORS_ADC3: H1.A6(ADC7) ; also sheet 1
CC2538_NRESET: H4.10 ; also sheet 1,3,5
GND: H1.A1(AGND) H1.A2(AGND) H1.A11(AGND) H1.A12(AGND) H1.B18(CPDGND) H1.B24(DGND) H1.C39(DGND) H4.3 H4.5 H4.9 ; also sheet 1,2,3,4,5
GNDA: H1.B17(USBGND) ; also sheet 3,5
GPIO_INT_RAIN: H1.C49(CA2)
I2C_SCL: H1.B26(I2C_SCL) ; also sheet 1,5
I2C_SDA: H1.B28(I2C_SDA) ; also sheet 1,5
JTAG_TCK: H4.4 ; also sheet 1
JTAG_TDI/FLASH_SPI_CSN: H4.8 ; also sheet 1,4
JTAG_TDO/SD_PRESENCE: H4.6 ; also sheet 1,4
JTAG_TMS: H4.2 ; also sheet 1
N$35: H1.A15(ADC0)
N$36: H1.A5(ADC3)
N$37: H1.A7(ADC4)
N$38: H1.A10(ADC5)
N$39: H1.A8(ADC6)
N$41: H1.C51(TA0)
PWR_RADIO_EN: H1.B30(TB2) ; also sheet 1,2
PWR_SENSE_EN: H1.B25(TEMP_PMR) H1.B32(TB0) ; also sheet 1,5
RADIO_GPIO0: H1.C54(CAOUT) ; also sheet 1,2
RADIO_GPIO2: H1.C42(TB3) ; also sheet 1,2
RADIO_RESET_N: H1.C43(CA6) ; also sheet 1,2
RADIO_SPI_CLK: H1.B34(SPI_CLK) ; also sheet 1,2
RADIO_SPI_CSN: H1.C48(CA3) ; also sheet 1,2
RADIO_SPI_MISO: H1.B40(SPI_SOMI) ; also sheet 1,2
RADIO_SPI_MOSI: H1.B36(SPI_SIMO) ; also sheet 1,2
RS485_TXEN: H1.C46(CA0) ; also sheet 1
SD_SPI_CLK: H1.C45(CA1) ; also sheet 1,4
SD_SPI_MISO: H1.C52(TA1) ; also sheet 1,4
SD_SPI_MOSI: H1.C50(TA2) ; also sheet 1,4
TEMP_ALERT: H1.C41(ALERT) ; also sheet 5
UART0_RX: H1.B35(UART0_RX) H1.C47(BSL_RX) ; also sheet 1,3
UART0_TX: H1.B37(UART0_TX) H1.C53(BSL_TX) ; also sheet 1,3
UART1_RX: H1.B31(UART1_RX) ; also sheet 1
UART1_TX: H1.B33(UART1_TX) ; also sheet 1
USB_D_N: H1.B21(D_N) ; also sheet 3
USB_D_P: H1.B19(D_P) ; also sheet 3
USER_BUTTON: H1.C44(USER_INT) ; also sheet 1,3,5
Unconnected: H1.B27(TBCLK) H1.B29(UCBICLK) H4.7

### Buses
JTAG_TMS,JTAG_TCK,JTAG_TDO/SD_PRESENCE,JTAG_TDI/FLASH_SPI_CSN
CC2538_NRESET,USER_BUTTON
RADIO_SPI_CSN,RADIO_GPIO0
RADIO_SPI_MOSI,RADIO_SPI_CLK,RADIO_SPI_MISO
RADIO_RESET_N,RADIO_GPIO2
RS485_TXEN,PWR_SENSE_EN,PWR_RADIO_EN
UART0_RX,UART0_TX
ADC_SENSORS_ADC[1..3]
UART1_RX,UART1_TX
I2C_SDA,I2C_SCL
SD_SPI_CLK,SD_SPI_MOSI,SD_SPI_MISO
USB_D_P,USB_D_N,+5V_USB,GNDA
TEMP_ALERT

## Library data of the parts
ANT = CC11x:UFL: http://onecall.farnell.com/hirose-hrs/u-fl-r-smt-1-10/rf-coaxial-u-fl-straight-jack/dp/1688077
ANT_868 = CC11x:SMA
C1-C6 C11 C14-C23 C51 C61 C121 C131 C151 C171-C173 C211 C221 C231 C251 C261 C271 C281 C291 C301 C302 C311 = CC11x:C_EU
C7-C10 C12 C13 = rcl:C-EU: CAPACITOR, European symbol
D1 = diode:BAT54S: Schottky Diodes Pin connection corrected 2011-05-04 Source: Fairchild .. BAT54.pdf
F1 = CC11x:0900PC15J0013: CC1120 one-piece output filter. http://onecall.farnell.com/johanson-technology/0900pc15j0013e/balun-imp-matched-868-928mhz-chip/dp/2341894 http://www.johansontechnology.com/datasheets/highly-integrated-passive-components/0900PC15J0013.pdf
F2 = CC11x:BALUN: Alternative item: http://uk.farnell.com/johanson-technology/2450bm15a0002e/balun-filter-2-45ghz/dp/1885515; PARTNUMBER: 2341895; URL: http://uk.farnell.com/johanson-technology/2450bm15a0015e/balun-imp-matched-2-4-2-5ghz-50ohm/dp/2341895
H1 = z1:Z1
H4 = CC11x:FTS-105-01-L-D; DESCRIPTION: CONN HEADER, 1.27MM, THRU HOLE, 10WAY; MPN: FTS-105-01-L-D; OCFARNELL: 1667728; OCNEWARK: 11P4652; PACKAGE: HEADER, 1.27MM, THRU HOLE, 10WAY; SUPPLIER: Samtec
J1 = CC11x:47346-0001: CONN RCPT 5POS MICRO USB R/A SMD; MPN: 47346-0001; OC_FARNELL: 1568026; OC_NEWARK: 47M0505; PACKAGE: 5 POS MICRO USB R/A; SUPPLIER: MOLEX
L1-L5 L171 = CC11x:L_US
LED = CC11x:CLV1A-FKB-CJ1M1F1BB7R4S3: http://onecall.farnell.com/cree/clv1a-fkb-cj1m1f1bb7r4s3/led-red-grn-blu-550-850-320-mcd/dp/1855553
LED1 LED2 = led:LED: LED OSRAM: - CHIPLED LG R971, LG N971, LY N971, LG Q971, LY Q971, LO R971, LY R971 LH N974, LH R974 LS Q976, LO Q976, LY Q976 LO Q996 - Hyper CHIPLED LW Q18S LB Q993, LB Q99A, LB R99A - SideLED LS A670, LO A670, LY A670, LG A670, LP A670 LB A673, LV A673, LT A673, LW A673 LH A674 LY A675 LS A676, LA A676, LO A676, LY A676, LW A676 LS A679, LY A679, LG A679 - Hyper Micro SIDELED® LS Y876, LA Y876, LO Y876, LY Y876 LT Y87S - SmartLED LW L88C, LW L88S LB L89C, LB L89S, LG L890 LS L89K, LO L89K, LY L89K LS L896, LA L896, LO L896, LY L896 - TOPLED LS T670, LO T670, LY T670, LG T670, LP T670 LSG T670, LSP T670, LSY T670, LOP T670, LYG T670 LG T671, LOG T671, LSG T671 LB T673, LV T673, LT T673, LW T673 LH T674 LS T676, LA T676, LO T676, LY T676, LB T676, LH T676, LSB T676, LW T676 LB T67C, LV T67C, LT T67C, LS T67K, LO T67K, LY T67K, LW E67C LS E67B, LA E67B, LO E67B, LY E67B, LB E67C, LV E67C, LT E67C LW T67C LS T679, LY T679, LG T679 LS T770, LO T770, LY T770, LG T770, LP T770 LB T773, LV T773, LT T773, LW T773 LH T774 LS E675, LA E675, LY E675, LS T675 LS T776, LA T776, LO T776, LY T776, LB T776 LHGB T686 LT T68C, LB T68C - Hyper Mini TOPLED® LB M676 - Mini TOPLED Santana® LG M470 LS M47K, LO M47K, LY M47K Source: http://www.osram.convergy.de LUXEON: - LUMILED® LXK2-PW12-R00, LXK2-PW12-S00, LXK2-PW14-U00, LXK2-PW14-V00 LXK2-PM12-R00, LXK2-PM12-S00, LXK2-PM14-U00 LXK2-PE12-Q00, LXK2-PE12-R00, LXK2-PE12-S00, LXK2-PE14-T00, LXK2-PE14-U00 LXK2-PB12-K00, LXK2-PB12-L00, LXK2-PB12-M00, LXK2-PB14-N00, LXK2-PB14-P00, LXK2-PB14-Q00 LXK2-PR12-L00, LXK2-PR12-M00, LXK2-PR14-Q00, LXK2-PR14-R00 LXK2-PD12-Q00, LXK2-PD12-R00, LXK2-PD12-S00 LXK2-PH12-R00, LXK2-PH12-S00 LXK2-PL12-P00, LXK2-PL12-Q00, LXK2-PL12-R00 Source: www.luxeon.com KINGBRIGHT: KA-3528ASYC Source: www.kingbright.com
LED_EN = CC11x:PINHD-1X2: PIN HEADER
R1-R11 R13-R31 = rcl:R-EU_: RESISTOR, European symbol
R12 R141 R171 = CC11x:R_EU
RST USR = CC11x:KMR2X1G: http://onecall.farnell.com/c-k-components/kmr231g-lfs/switch-smd-3n-spst-0-05a-32vdc/dp/1437636 http://onecall.farnell.com/c-k-components/kmr241g-lfs/switch-smd-4n-0-05a-32vdc-spst/dp/1437637 http://onecall.farnell.com/c-k-components/kmr221g-lfs/switch-spst-0-05a-32vdc-smd/dp/1201424 . Side mount: http://onecall.farnell.com/c-k-components/kms221g-lfs/switch-spst-0-05a-32vdc-smd/dp/1437638
SD1 = glacsweb:MICRO_SD-SPI: Micro SD Socket configured for SPI.; MANUFACTURER: Molex; MPN: 503182-0853; OC_FARNELL: 2064061; PACKAGE: Pins in Entry
U1 = arm-cores:CC2538
U2 = CC11x:CC1120_RHM_32; DATASHEETURL: http://www.ti.com/lit/gpn/CC1120; DESCRIPTION: High Performance RF Transceiver for Narrowband Systems; FAMILY_NAME: SUB-1 GHZ; GENERIC_PART_NUMBER: CC1120; INDUSTRY_STD_PKG_TYPE: QFN; MANUFACTURER: Texas Instruments; PACKAGE_DESIGNATOR: RHM; PIN_COUNT: 32
U3 = Texas Instruments_By_element14_Batch_1:TPD2E001IDRLRQ1: LOW-CAPACITANCE 2-CHANNEL ±15-kV ESD-PROTECTION ARRAY; MPN: TPD2E001IDRLRQ1; OC_FARNELL: -; OC_NEWARK: 55R7553; PACKAGE: SOT-23-5; SUPPLIER: Texas Instruments
U4 = CC11x:CP2103
U5-U7 = CC11x:BSS138PS: Dual N-channel Trench MOSFET; MPN: BSS138PS; OC_FARNELL: 1972664; OC_NEWARK: 58T9002; PACKAGE: SOT-363-6; SUPPLIER: NXP
U8 = CC11x:M25P16: http://onecall.farnell.com/micron/m25p16-vmn6p/memory-flash-serial-16mbit-8nsoic/dp/1734973
U9 U10 = farnell-parts:DMG6602SVT
U11 = CC11x:SN74AVC4T774PW: 4-BIT DUAL-SUPPLY BUS TRANSCEIVER; MPN: SN74AVC4T774PW; OC_FARNELL: 1630205; OC_NEWARK: 85M0107; PACKAGE: TSSOP-16; SUPPLIER: Texas Instruments
U12 = CC11x:TMP102AIDRLT: Temperature Sensor; MPN: TMP102AIDRLT; OC_FARNELL: 1652477; OC_NEWARK: 53M3987; PACKAGE: SOT-23-6; SUPPLIER: Texas Instruments
X1 = crystal:FA-: MHz RANGE CRYSTAL UNIT Source: Epson Toyocom
X2 = arm-cores:ABM8G; PARTNUM: 2467852; URL: http://uk.farnell.com/abracon/abm8g-32-000mhz-b4y-t/crystal-32mhz-10pf-3-2-x-2-5mm/dp/2467852
X3 = arm-cores:ABS07: 32 KHz: http://onecall.farnell.com/abracon/abs07-32-768khz-t/crystal-32-768khz-12-5pf-smd/dp/2101347